# EAGLE schematic LEDDriver (EAGLE 7.4.0)
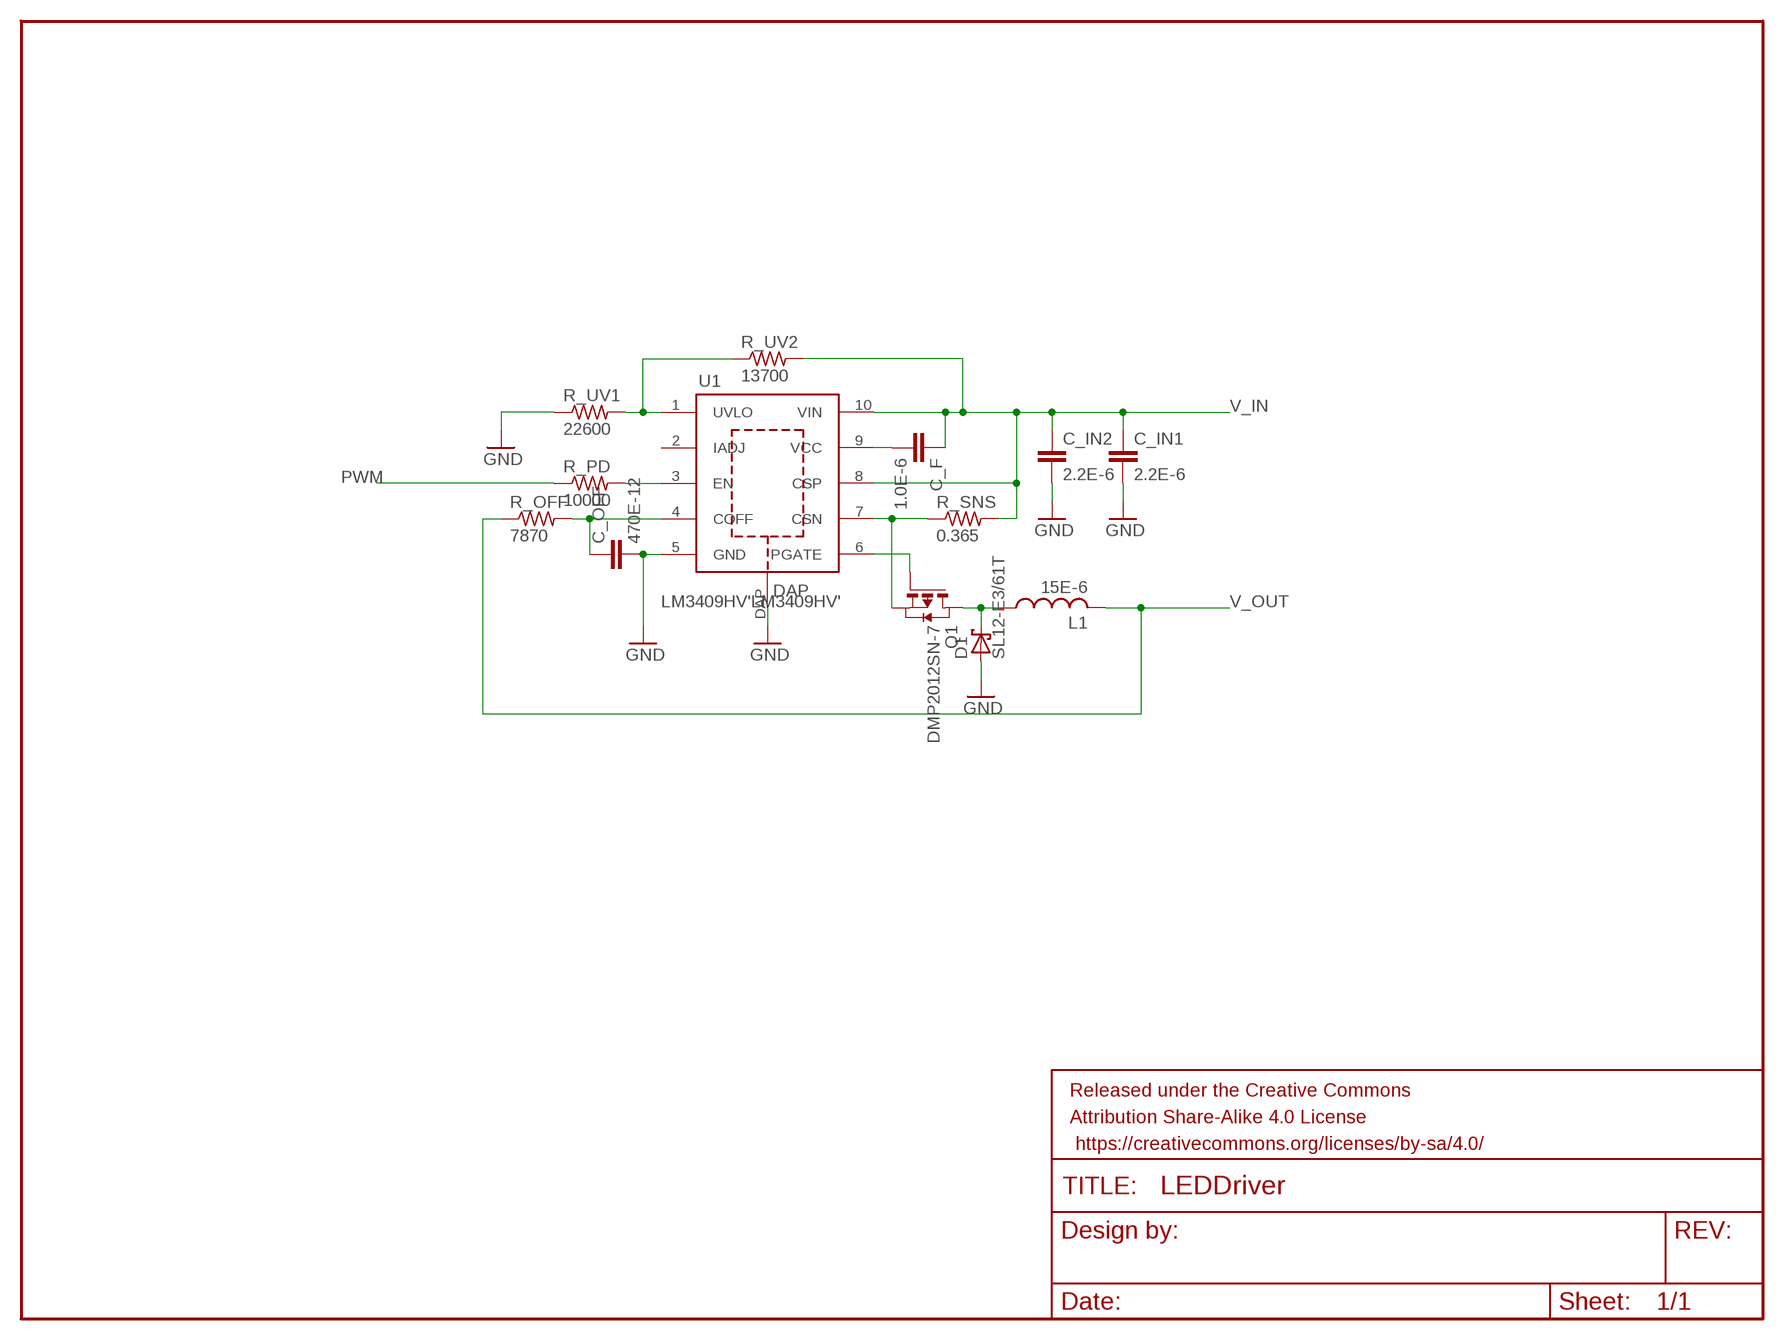
[diagram p0: schematic, sheet 1]

## Parts
C_F  1.0E-6  CC0603  [C0603]
C_IN1  2.2E-6  CC0603  [C0603]
C_IN2  2.2E-6  CC0603  [C0603]
C_OFF  470E-12  CC0402  [C0402]
D1  SL12-E3/61T  [SL12-E3/61T]
FRAME1  FRAME-LETTER  [CREATIVE_COMMONS]
L1  15E-6  SRN8040  [SRN8040]
Q1  DMP2012SN-7  [DMP2012SN-7]
R_OFF  7870  R-US_R0603  [R0603]
R_PD  10000  R-US_R0603  [R0603]
R_SNS  0.365  R-US_R2512  [R2512]
R_UV1  22600  R-US_R0603  [R0603]
R_UV2  13700  R-US_R0603  [R0603]
U1  LM3409HV'LM3409HV'  [VSSOP-10]

## Nets
GND: C_IN1.2 C_IN2.2 C_OFF.2 D1.2(A) R_UV1.1 U1.5(GND) U1.DAP
L1: D1.1(C) L1.1 Q1.1(D)
N$1: C_F.2 U1.9(VCC)
N$2: R_UV1.2 R_UV2.1 U1.1(UVLO)
N$3: Q1.2(G) U1.6(PGATE)
N$5: R_PD.2 U1.3(EN)
N$6: C_OFF.1 R_OFF.2 U1.4(COFF)
N$8: Q1.3(S) R_SNS.1 U1.7(CSN)
PWM: R_PD.1
V_IN: C_F.1 C_IN1.1 C_IN2.1 R_SNS.2 R_UV2.2 U1.8(CSP) U1.10(VIN)
V_OUT: L1.2 R_OFF.1
Unconnected: U1.2(IADJ)

## Library data of the parts
C_F C_IN1 C_IN2 C_OFF = eagle-ltspice:C: CAPACITOR, European symbol; SPICEMODEL: NONE; SPICEPREFIX: C
D1 = DiscreteComponents:SL12-E3/61T
FRAME1 = SparkFun-Aesthetics:FRAME-LETTER: Schematic Frame Standard 8.5x11 US Letter frame
L1 = DiscreteComponents:SRN8040
Q1 = DiscreteComponents:DMP2012SN-7
R_OFF R_PD R_SNS R_UV1 R_UV2 = DiscreteComponents:R-US_: RESISTOR, American symbol
U1 = 2015_LED_Driver:LM3409HV